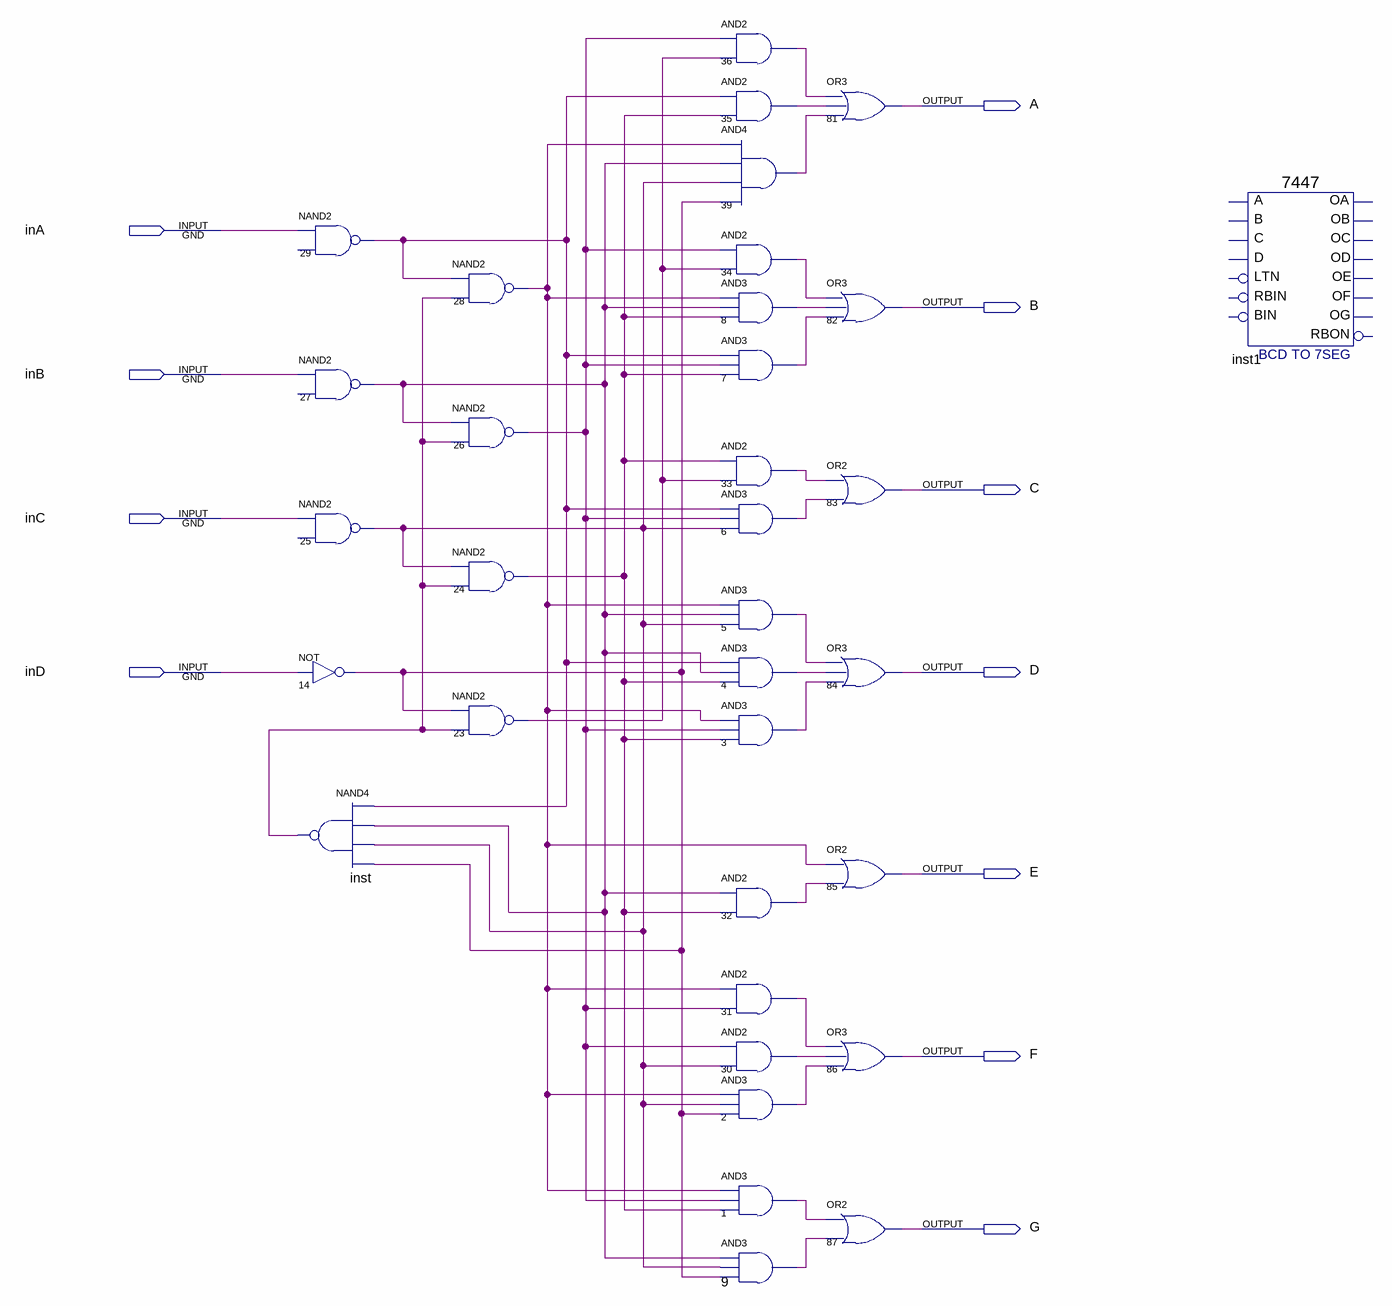
[diagram p0: schematic sheet]
// Quartus schematic newsegmentdecoder7.bdf as structural Verilog: 34 symbols, 11 pins
module newsegmentdecoder7 (
  input  inA,
  input  inB,
  input  inC,
  input  inD,
  output A,
  output B,
  output C,
  output D,
  output E,
  output F,
  output G
);

  wire inst_out, n1_out, n2_out, n3_out, n4_out, n5_out, n6_out, n7_out, n8_out, n9_out, n14_out, n23_out,
       n24_out, n25_out, n26_out, n27_out, n28_out, n29_out, n30_out, n31_out, n32_out, n33_out, n34_out,
       n35_out, n36_out, n39_out;

  not u_29 (n29_out, inA);  // NAND2 open: IN2
  not u_27 (n27_out, inB);  // NAND2 open: IN2
  not u_25 (n25_out, inC);  // NAND2 open: IN2
  not u_14 (n14_out, inD);
  nand inst (inst_out, n29_out, n27_out, n25_out, n14_out);
  nand u_28 (n28_out, n29_out, inst_out);
  nand u_26 (n26_out, n27_out, inst_out);
  nand u_24 (n24_out, n25_out, inst_out);
  nand u_23 (n23_out, n14_out, inst_out);
  and u_36 (n36_out, n26_out, n23_out);
  and u_35 (n35_out, n29_out, n24_out);
  and u_39 (n39_out, n28_out, n27_out, n25_out, n14_out);
  and u_34 (n34_out, n26_out, n23_out);
  and u_8 (n8_out, n28_out, n27_out, n24_out);
  and u_7 (n7_out, n29_out, n26_out, n24_out);
  and u_33 (n33_out, n24_out, n23_out);
  and u_6 (n6_out, n29_out, n26_out, n25_out);
  and u_5 (n5_out, n28_out, n27_out, n25_out);
  and u_4 (n4_out, n29_out, n27_out, n24_out);
  and u_3 (n3_out, n28_out, n26_out, n24_out);
  and u_32 (n32_out, n27_out, n24_out);
  and u_31 (n31_out, n28_out, n26_out);
  and u_30 (n30_out, n26_out, n25_out);
  and u_2 (n2_out, n28_out, n25_out, n14_out);
  and u_1 (n1_out, n28_out, n26_out, n24_out);
  and u_9 (n9_out, n27_out, n25_out, n14_out);
  or u_81 (A, n36_out, n35_out, n39_out);
  or u_82 (B, n34_out, n8_out, n7_out);
  or u_83 (C, n33_out, n6_out);
  or u_84 (D, n5_out, n4_out, n3_out);
  or u_85 (E, n28_out, n32_out);
  or u_86 (F, n31_out, n30_out, n2_out);
  or u_87 (G, n1_out, n9_out);
  \7447  inst1 ();  // open: LTN, B, C, D, RBIN, BIN, A, OB, OC, OE, OD, OF, OG, OA, RBON
endmodule
